# EAGLE design MAIN_STACK_V1 (EAGLE 7.5.0)
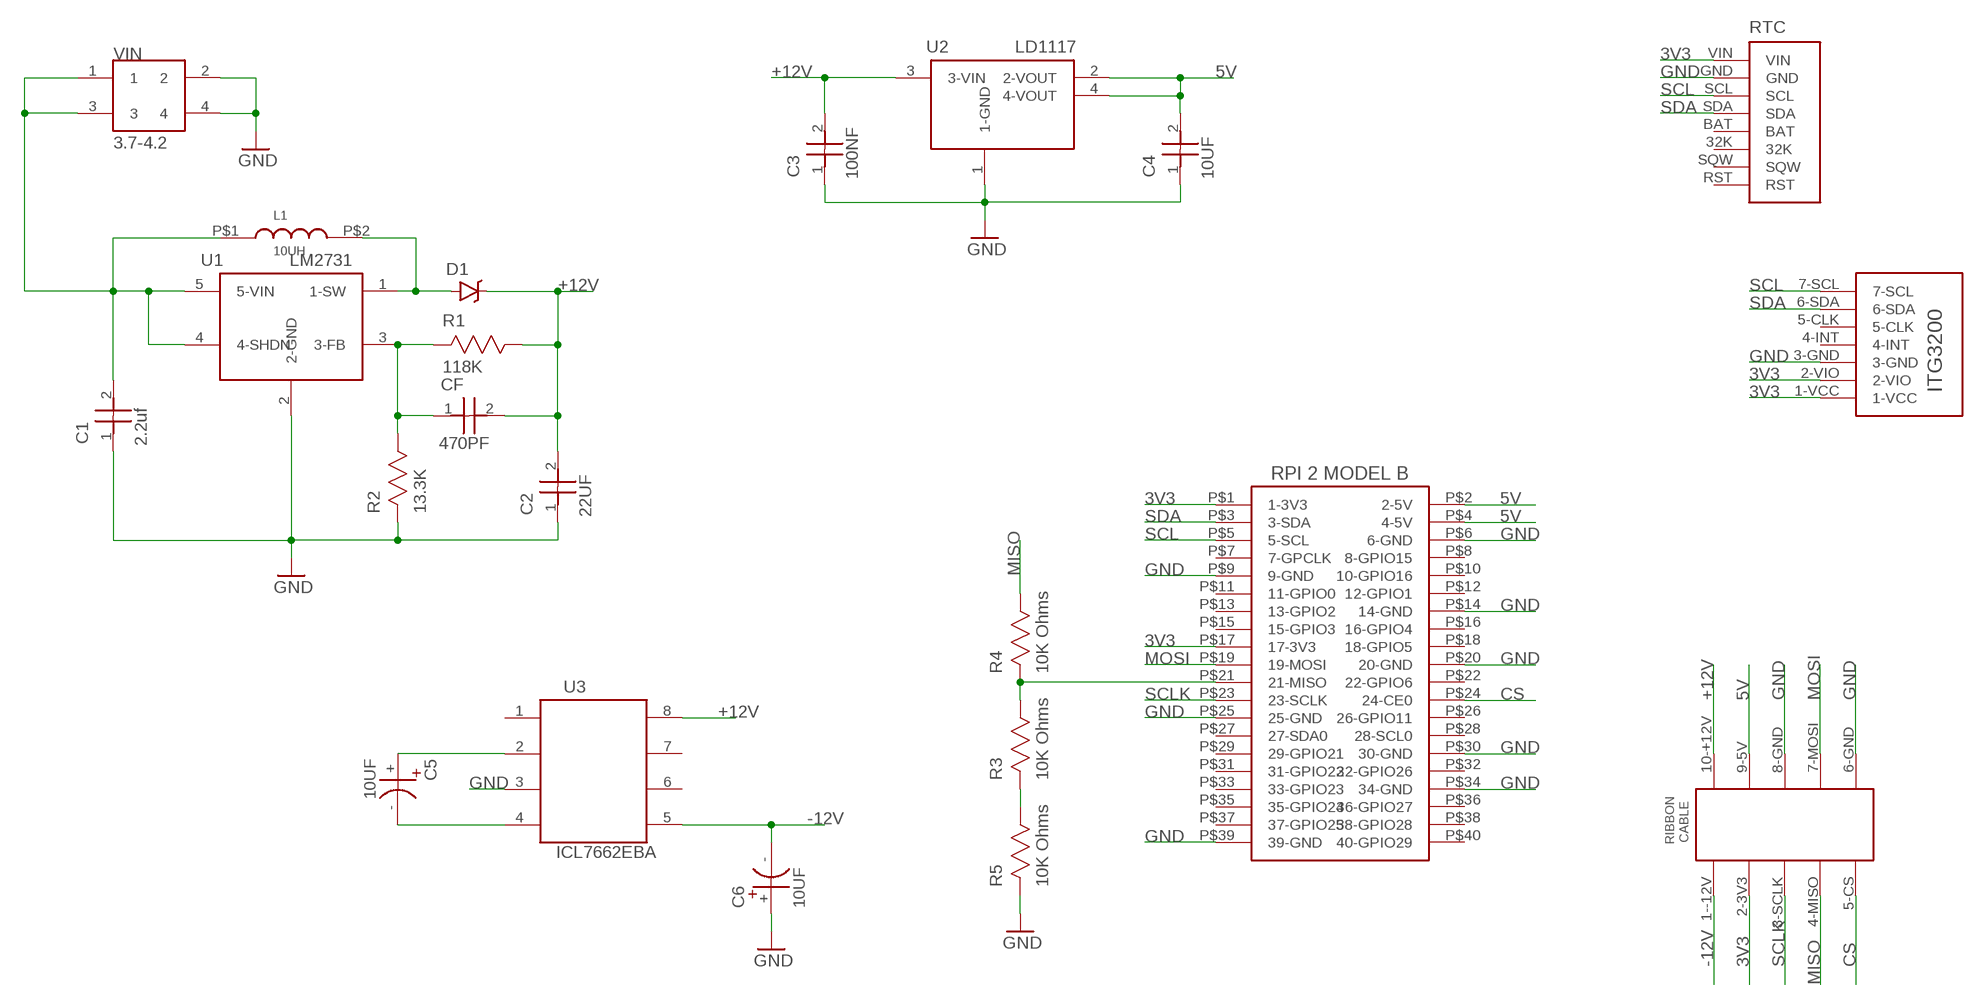
[diagram p0: schematic, sheet 1]

## Parts
C1  2.2uf  CAP1206  [CAP1206]
C2  22UF  CAP1206  [CAP1206]
C3  100NF  CAP1206  [CAP1206]
C4  10UF  CAP1206  [CAP1206]
C5  10UF  POLCAP9B  [KEMET9BPOLCAP]
C6  10UF  POLCAP9B  [KEMET9BPOLCAP]
CF  470PF  CAP1206  [CAP1206]
D1  DIODE-SCHOTTKY  [SOD-123]
L1  10UH  CDRH125NP  [CDRH125NP]
R1  118K  RES1206  [RES1206]
R2  13.3K  RES1206  [RES1206]
R3  10K Ohms  RES1206  [RES1206]
R4  10K Ohms  RES1206  [RES1206]
R5  10K Ohms  RES1206  [RES1206]
RTC  DS3231BREAKOUT  [DS3231BREAKOUT]
U1  LM2731  LM2731YMF/NOPB  [SOT95]
U2  LD1117  [SOT223]
U3  ICL7662EBA  [SOIC8]
U$1  RPI2  [RPI2]
U$2  ITG3200  [ITG3200]
U$3  5X2RIBBONCONNECTOR  [5X2RIBBONCONNECTOR]
VIN  3.7-4.2  HIROSECONNECTOR  [HIROSEPOWERCONNECTOR]

## Nets
3V3: RTC.VIN U$1.P$1(1-3V3) U$1.P$17(17-3V3) U$2.1-VCC U$2.2-VIO U$3.2-3V3
5V: C4.2 U2.2(2-VOUT) U2.4(4-VOUT) U$1.P$2(2-5V) U$1.P$4(4-5V) U$3.9-5V
+12V: C2.2 C3.2 CF.2 D1.C R1.1 U2.3(3-VIN) U3.8(8-V+) U$3.10-+12V
-12V: C6.- U3.5(5-VOUT) U$3.1--12V
CS: U$1.P$24(24-CE0) U$3.5-CS
GND: C1.1 C2.1 C3.1 C4.1 C6.+ R2.2 R5.2 RTC.GND U1.2(2-GND) U2.1(1-GND) U3.3(3-GND) U$1.P$6(6-GND) U$1.P$9(9-GND) U$1.P$14(14-GND) U$1.P$20(20-GND) U$1.P$25(25-GND) U$1.P$30(30-GND) U$1.P$34(34-GND) U$1.P$39(39-GND) U$2.3-GND U$3.6-GND U$3.8-GND VIN.2 VIN.4
MISO: R4.1 U$3.4-MISO
MOSI: U$1.P$19(19-MOSI) U$3.7-MOSI
N$2: C5.+ U3.2(2-CAP+)
N$3: D1.A L1.P$2 U1.1(1-SW)
N$4: C5.- U3.4(4-CAP-)
N$5: CF.1 R1.2 R2.1 U1.3(3-FB)
N$6: R3.1 R4.2 U$1.P$21(21-MISO)
N$7: R3.2 R5.1
SCL: RTC.SCL U$1.P$5(5-SCL) U$2.7-SCL
SCLK: U$1.P$23(23-SCLK) U$3.3-SCLK
SDA: RTC.SDA U$1.P$3(3-SDA) U$2.6-SDA
VIN: C1.2 L1.P$1 U1.4(4-SHDN) U1.5(5-VIN) VIN.1 VIN.3
Unconnected: RTC.32K RTC.BAT RTC.RST RTC.SQW U3.1(1-TEST) U3.6(6-LV) U3.7(7-OSC) U$1.P$7(7-GPCLK) U$1.P$8(8-GPIO15) U$1.P$10(10-GPIO16) U$1.P$11(11-GPIO0) U$1.P$12(12-GPIO1) U$1.P$13(13-GPIO2) U$1.P$15(15-GPIO3) U$1.P$16(16-GPIO4) U$1.P$18(18-GPIO5) U$1.P$22(22-GPIO6) U$1.P$26(26-GPIO11) U$1.P$27(27-SDA0) U$1.P$28(28-SCL0) U$1.P$29(29-GPIO21) U$1.P$31(31-GPIO22) U$1.P$32(32-GPIO26) U$1.P$33(33-GPIO23) U$1.P$35(35-GPIO24) U$1.P$36(36-GPIO27) U$1.P$37(37-GPIO25) U$1.P$38(38-GPIO28) U$1.P$40(40-GPIO29) U$2.4-INT U$2.5-CLK

## Library data of the parts
C1-C4 CF = RSC-16:CAP1206: CAPACITOR, 1206; MPN: C1206C103K5RACTU; OC_FARNELL: 1414713; OC_NEWARK: 61H7741; SUPPLIER: Kemet; TOLERANCE: ±10%; VALUE: 10nF; VOLTAGERATING: 50V
C5 C6 = RSC-16:POLCAP9B
D1 = RSC-16:DIODE-SCHOTTKY
L1 = RSC-16:CDRH125NP
R1 R2 = RSC-16:RES1206: RESISTOR, 1206; MPN: CRCW120610K0FKEA; OC_FARNELL: 1469970; OC_NEWARK: 53K1907; SUPPLIER: Vishay; TOLERANCE: ±1%; VALUE: 10K Ohms; WATTAGE: 0.25W
R3-R5 = RSC-16:RES1206: RESISTOR, 1206; MPN: CRCW120610K0FKEA; OC_FARNELL: 1469970; OC_NEWARK: 53K1907; SUPPLIER: Vishay; TOLERANCE: ±1%; WATTAGE: 0.25W
RTC = RSC-16:DS3231BREAKOUT
U1 = RSC-16:LM2731YMF/NOPB
U2 = RSC-16:LD1117
U3 = RSC-16:ICL7662EBA
U$1 = RSC-16:RPI2
U$2 = RSC-16:ITG3200
U$3 = RSC-16:5X2RIBBONCONNECTOR
VIN = RSC-16:HIROSECONNECTOR

## Board
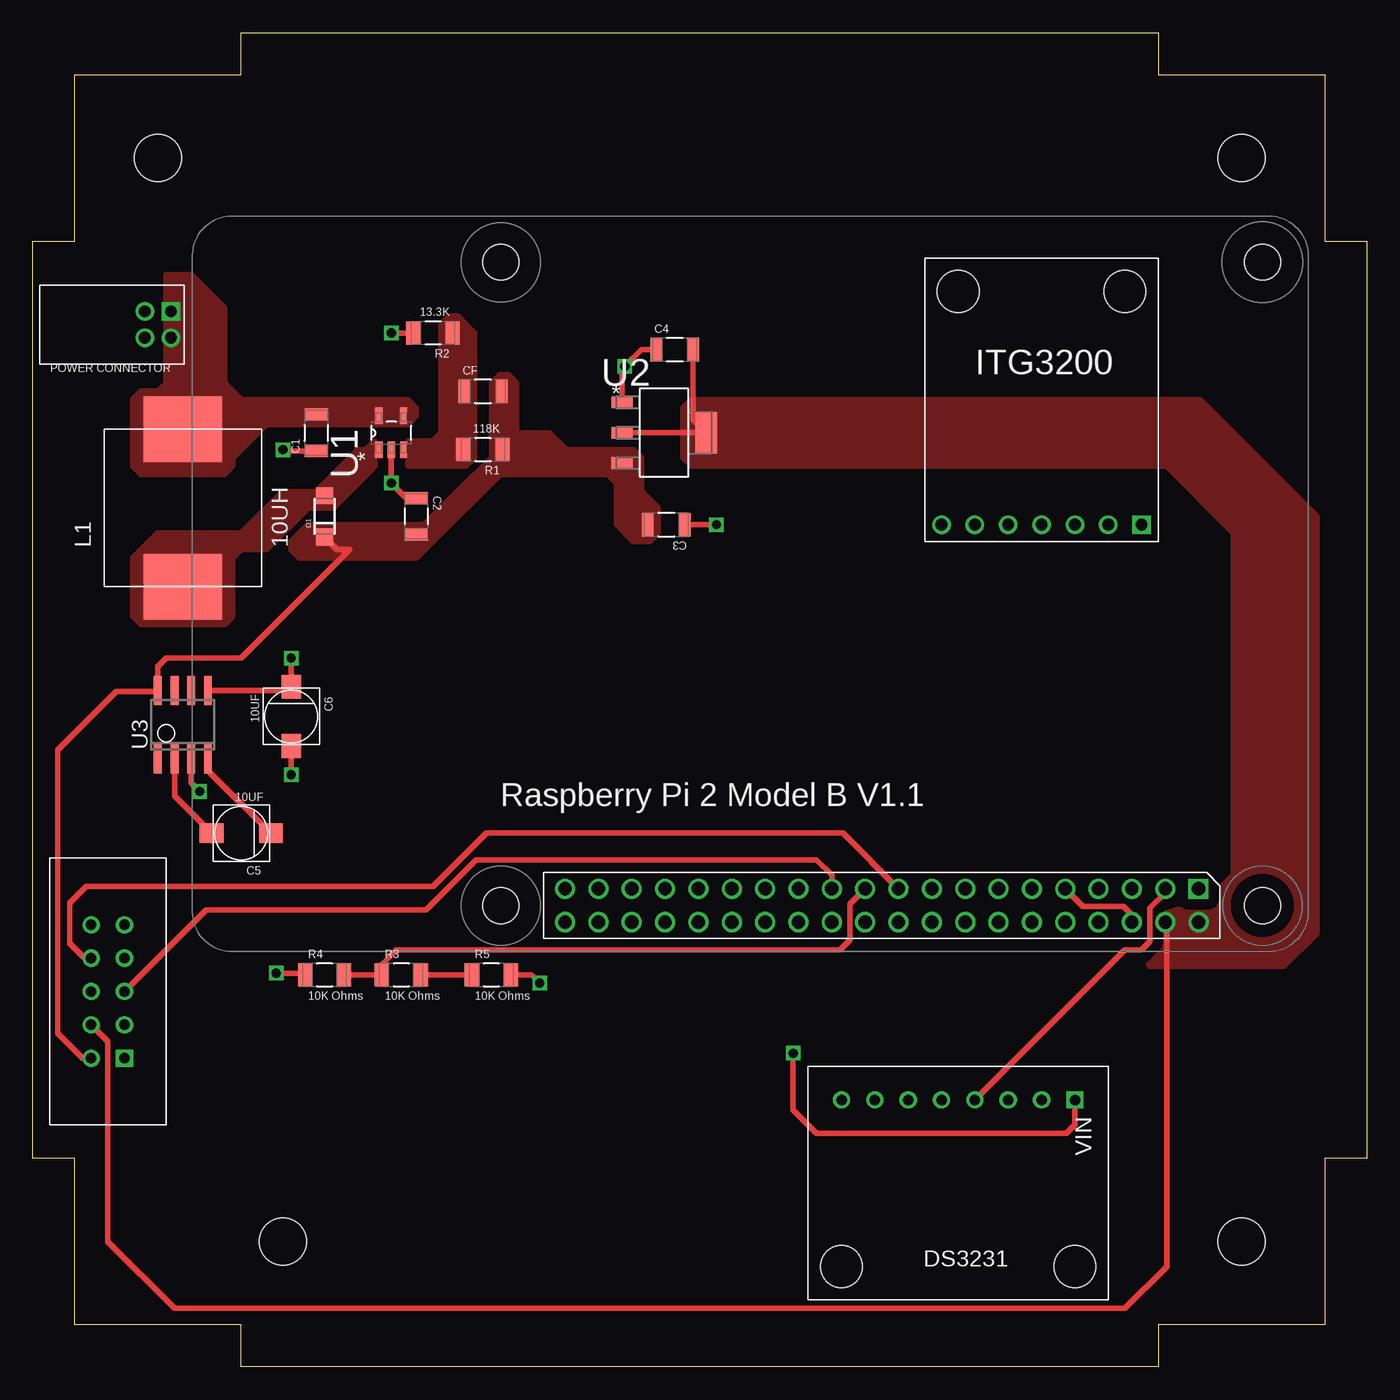
[diagram p1: board, top side]
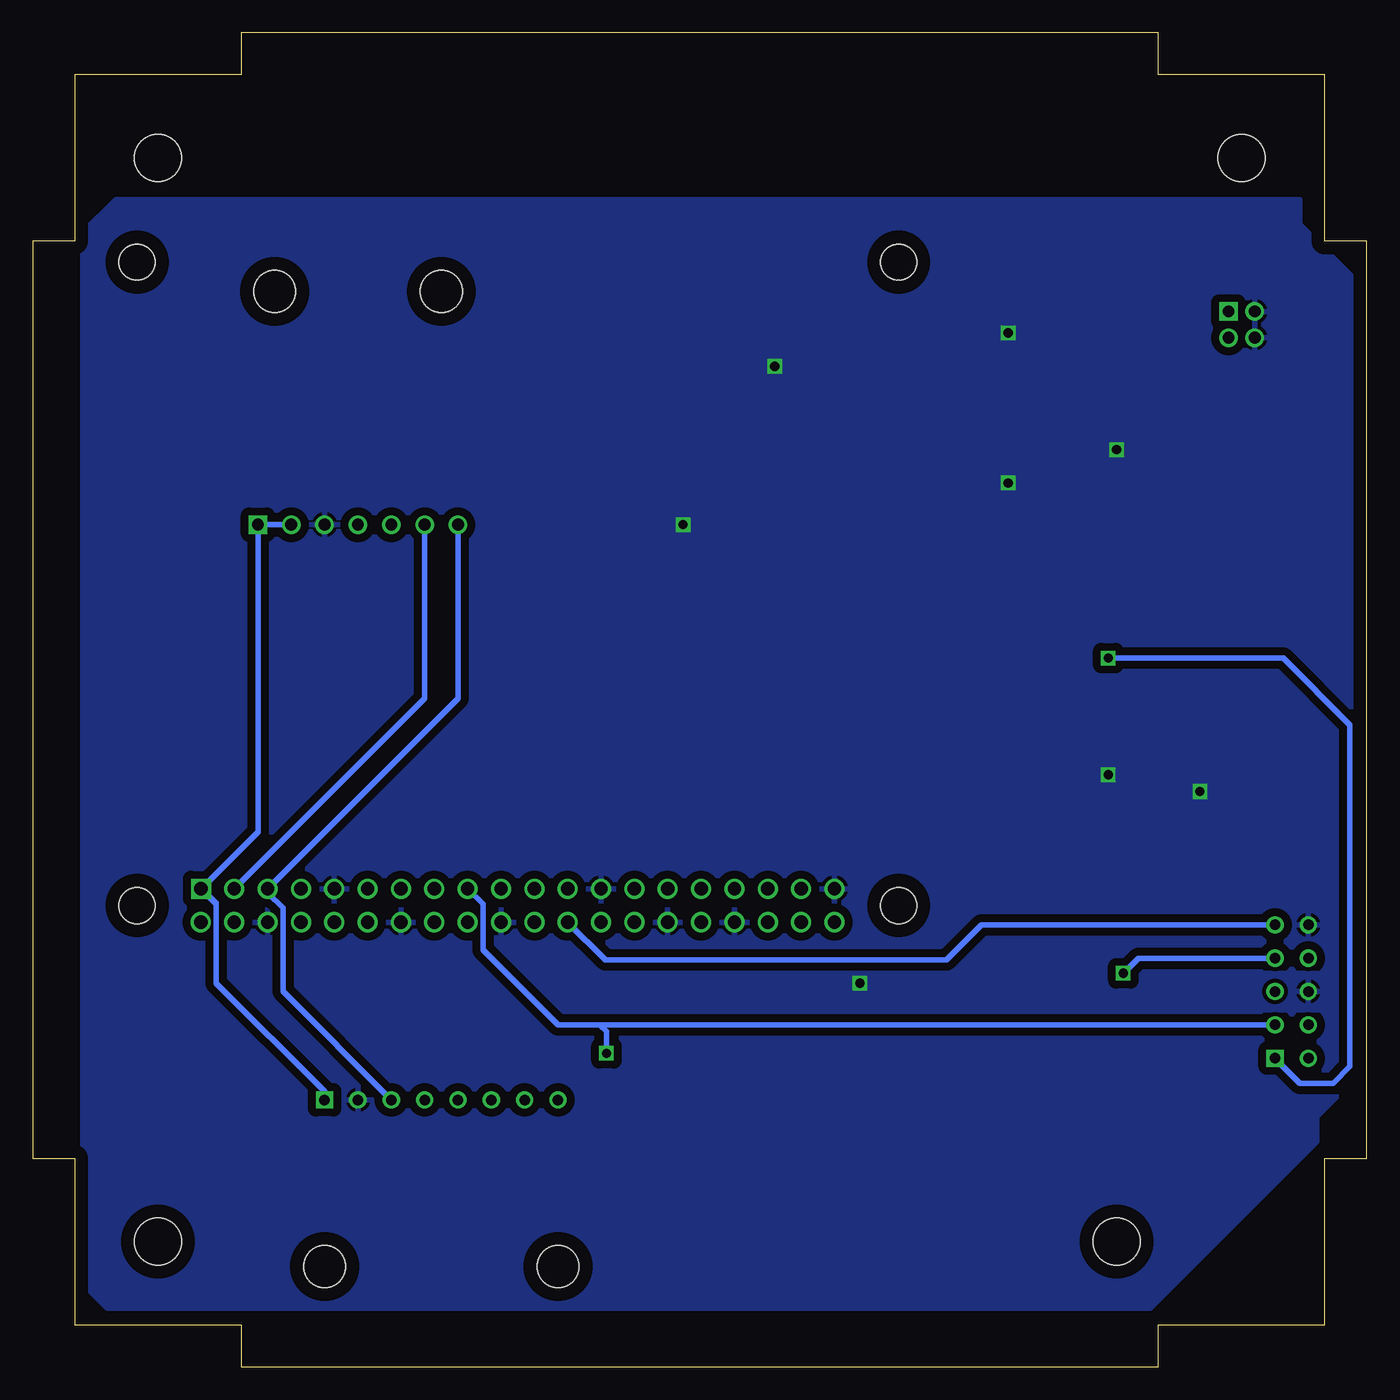
[diagram p2: board, bottom side, seen from below]

Size 101.6 x 101.6 mm. Coordinates in mm from the lower left corner, seen from the top.
Outline: 15.88,0 15.88,3.17 3.17,3.17 3.17,15.88 0,15.88 0,85.72 3.17,85.72 3.17,98.42 15.88,98.42 15.88,101.6 85.72,101.6 85.72,98.42 98.42,98.42 98.42,85.72 101.6,85.72 101.6,15.88 98.42,15.88 98.42,3.17 85.72,3.17 85.72,0 15.88,0
Copper layers (1*16): Top 0.035mm / dielectric 1.5mm / Bottom 0.035mm
Design rules "default": minimum track width 10mil, minimum drill 24mil, track to track 8mil, track to pad 8mil, pad to pad 8mil, via to via 8mil, smd to smd 8mil, copper to edge 40mil, drill to drill 8mil, minimum pad ring 10mil, minimum via ring 8mil, stop-mask expansion 4mil, vias tented up to drill 0mil, thermal gap 10mil
Holes 3.58 mm at 19.05,9.53 9.53,92.08 92.08,92.08 92.08,9.53

### Footprints (pad centres in the part's own frame; a part is rotated, then mirrored left to right if it is on the bottom)
CAP1206 = smd 0.914 x 1.803: 1 -1.397,0; 2 1.397,0
KEMET9BPOLCAP = smd 1.8 x 1.5: + 2.25,0; - -2.25,0
SOD-123 = smd 1.27 x 1.27: A 1.575,0; C -1.575,0
CDRH125NP = smd 6 x 5: P$1 0,6; P$2 0,-6
RES1206 = smd 1.118 x 1.753: 1 -1.473,0; 2 1.473,0
DS3231BREAKOUT = drill 0.8: 32K 15.24,2.54; BAT 12.7,2.54; GND 5.08,2.54; RST 20.32,2.54; SCL 7.62,2.54; SDA 10.16,2.54; SQW 17.78,2.54 | drill 0.8 square: VIN 2.54,2.54 | hole 3.2: 2.54,15.24; 20.32,15.24
SOT95 = smd 1.27 x 0.559: 1 -1.295,0.94; 2 -1.295,0; 3 -1.295,-0.94; 4 1.295,-0.94; 5 1.295,0.94
SOT223 = smd 1.626 x 0.889: 1 -3.2,2.311; 2 -3.2,0; 3 -3.2,-2.311 | smd 1.626 x 3.175: 4 3.2,0
SOIC8 = smd 0.6 x 2.2: 1 -1.905,-2.6; 2 -0.635,-2.6; 3 0.635,-2.6; 4 1.905,-2.6; 5 1.905,2.6; 6 0.635,2.6; 7 -0.635,2.6; 8 -1.905,2.6
RPI2 = drill 1.016 square: P$1 8.37,51.23 | drill 1.016: P$2 8.357,53.772; P$3 10.897,51.232; P$4 10.897,53.772; P$5 13.437,51.232; P$6 13.437,53.772; P$7 15.977,51.232; P$8 15.977,53.772; P$9 18.517,51.232; P$10 18.517,53.772; P$11 21.057,51.232; P$12 21.057,53.772; P$13 23.597,51.232; P$14 23.597,53.772; P$15 26.137,51.232; P$16 26.137,53.772; P$17 28.677,51.232; P$18 28.677,53.772; P$19 31.217,51.232; P$20 31.217,53.772; P$21 33.757,51.232; P$22 33.757,53.772; P$23 36.297,51.232; P$24 36.297,53.772; P$25 38.837,51.232; P$26 38.837,53.772; P$27 41.377,51.232; P$28 41.377,53.772; P$29 43.917,51.232; P$30 43.917,53.772; P$31 46.457,51.232; P$32 46.457,53.772; P$33 48.997,51.232; P$34 48.997,53.772; P$35 51.537,51.232; P$36 51.537,53.772; P$37 54.077,51.232; P$38 54.077,53.772; P$39 56.617,51.232; P$40 56.617,53.772 | hole 2.75: 3.5,3.5; 61.5,3.5; 3.5,52.5; 61.5,52.5
ITG3200 = drill 0.9 square: 1-VCC 20.32,16.51 | drill 0.9: 2-VIO 20.32,13.97; 3-GND 20.32,11.43; 4-INT 20.32,8.89; 5-CLK 20.32,6.35; 6-SDA 20.32,3.81; 7-SCL 20.32,1.27 | hole 3.2: 2.54,15.24; 2.54,2.54
5X2RIBBONCONNECTOR = drill 0.8 square: 1--12V -5.08,-1.27 | drill 0.8: 2-3V3 -2.54,-1.27; 3-SCLK 0,-1.27; 4-MISO 2.54,-1.27; 5-CS 5.08,-1.27; 6-GND 5.08,1.27; 7-MOSI 2.54,1.27; 8-GND 0,1.27; 9-5V -2.54,1.27; 10-+12V -5.08,1.27
HIROSEPOWERCONNECTOR = drill 0.9 square: 1 1,-1 | drill 0.9: 2 1,1; 3 -1,-1; 4 -1,1

### Placement (x,y rotation side)
C1  21.59,71.12 90 top
C2  29.21,64.77 270 top
C3  48.26,64.14 180 top
C4  48.9,77.47 0 top
C5  15.88,40.64 180 top
C6  19.68,49.53 270 top
CF  34.29,74.3 0 top
D1  22.23,64.77 90 top
L1  11.43,65.41 0 top
R1  34.29,69.85 180 top
R2  30.48,78.74 180 top
R3  28.07,29.84 0 top
R4  22.23,29.84 0 top
R5  34.92,29.84 0 top
RTC  81.92,22.86 180 top
U1  27.3,71.12 90 top
U2  48.09,71.14 0 top
U3  11.43,48.9 0 top
U$1  97.16,87.63 180 top
U$2  67.94,84.45 270 top
U$3  5.71,28.57 90 top
VIN  9.53,79.38 90 top

### Tracks (layer width: path | path; a pad name or v marks a point on that pad's centre or on a via)
3V3  (via drill 0.7)
  Top 0.406: RTC.VIN 79.38,18.41 78.74,17.78 59.69,17.78 57.91,19.56 v57.91,23.88
  Bottom 0.406: U$2.2-VIO U$2.1-VCC 84.45,40.73 U$1.P$1 87.63,35.24 | 87.63,35.24 87.63,29.21 79.38,20.95 RTC.VIN | U$3.2-3V3 58.42,26.04 | 58.42,26.04 61.59,26.04 67.31,31.75 67.31,35.23 U$1.P$17 | 87.63,35.24 87.63,35.31 88.65,36.32 | v57.91,23.88 57.91,25.53 58.42,26.04
5V
  Top 0.406: C4.2 50.29,72.13 U2.4 U2.2 | U$3.9-5V 5.71,24.77 5.71,9.53 10.79,4.45 83.19,4.45 86.36,7.62 86.36,33.76 U$1.P$4
  pour Top (isolate 0.813, no thermals): 49.53,70.48 49.53,69.22 50.16,68.58 86.36,68.58 91.44,63.5 91.44,37.47 89.53,35.56 85.09,35.56 84.45,34.92 84.45,31.11 85.09,30.48 95.25,30.48 97.79,33.02 97.79,64.77 88.9,73.66 50.16,73.66 49.53,73.03
+12V
  Top 0.406: D1.C 23.19,62.23 24.13,62.23 15.88,53.98 10.16,53.98 9.53,53.34 U3.8 9.46,51.44 6.35,51.44 1.91,46.99 1.91,25.4 3.81,23.5 U$3.10-+12V
  pour Top (no thermals): 20.95,64.14 19.68,62.87 19.68,62.23 20.32,61.59 29.21,61.59 36.83,69.22 36.83,74.93 36.2,75.56 35.56,75.56 34.92,74.93 34.92,69.22 33.66,67.94 29.84,64.14
  pour Top: 34.92,71.12 39.37,71.12 40.64,69.85 45.72,69.85 46.35,69.22 46.35,68.58 45.72,67.94 35.56,67.94 34.92,68.58
  pour Top (no thermals): 45.72,69.85 46.35,69.22 46.35,66.67 47.62,65.41 47.62,63.5 46.99,62.87 45.72,62.87 44.45,64.14 44.45,67.31 43.81,67.94 43.81,69.22 44.45,69.85
-12V  (via drill 0.7)
  Top 0.406: U3.5 19.4,51.49 C6.- v19.68,53.98
  Bottom 0.406: U$3.1--12V 5.08,21.59 2.54,21.59 1.27,22.86 1.27,48.9 6.35,53.98 v19.68,53.98
CS
  Bottom 0.406: U$3.5-CS 29.34,33.66 32,30.99 57.99,30.99 U$1.P$24
GND  (via drill 0.7)
  Top 0.406: C1.1 19.18,69.72 v19.05,69.85 | R2.2 v27.3,78.74 | C2.1 28.45,66.17 v27.3,67.31 U1.2 | U2.1 44.88,76 v45.09,76.2 46.35,77.47 C4.1 | v52.07,64.14 C3.1 | C6.+ v19.68,45.09 | U3.3 12.06,44.45 v12.7,43.81 | U$1.P$6 83.72,34.39 83.06,35.05 79.98,35.05 U$1.P$9 | R5.2 37.97,29.84 v38.61,29.21
  pour Bottom (isolate 0.61): 5.08,88.9 95.25,88.9 97.79,86.36 97.79,6.35 95.89,4.45 16.51,4.45 3.81,17.14 3.81,19.05 0.64,22.23 0.64,82.55 5.08,87
  pour Bottom (isolate 0.305): 3.81,29.97 8.13,29.97 8.64,29.46 8.64,27.69 8.13,27.18 3.56,27.18 3.3,27.43 3.3,29.46
MISO  (via drill 0.7)
  Top 0.406: v18.54,29.97 20.62,29.97 R4.1
  Bottom 0.406: U$3.4-MISO 17.4,31.11 v18.54,29.97
MOSI
  Top 0.406: U$3.7-MOSI 3.94,31.11 2.79,32.26 2.79,35.31 4.06,36.58 30.48,36.58 34.54,40.64 61.7,40.64 U$1.P$19
N$2
  Top 0.406: U3.2 10.79,43.47 C5.+
N$3
  pour Top (isolate 0.813, no thermals): 7.62,57.15 8.26,56.52 14.61,56.52 15.24,57.15 15.24,61.59 15.88,62.23 17.78,62.23 20.95,65.41 22.86,65.41 26.67,69.22 26.67,70.48 26.04,70.48 25.4,69.85 24.77,69.85 21.59,66.67 19.05,66.67 15.88,63.5 9.53,63.5 7.62,61.59
N$4
  Top 0.406: U3.4 13.34,45.43 C5.-
N$5
  pour Top (isolate 0.813, no thermals): 33.02,68.58 33.66,69.22 33.66,78.74 32.38,80.01 31.75,80.01 31.11,79.38 31.11,71.12 30.48,70.48 28.57,70.48 27.94,69.85 27.94,69.22 28.57,68.58
N$6
  Top 0.406: R4.2 R3.1 26.59,30.66 27.69,31.75 61.47,31.75 62.23,32.51 62.23,35.23 U$1.P$21
N$7
  Top 0.406: R3.2 R5.1
SCL
  Bottom 0.406: U$2.7-SCL 69.22,50.9 U$1.P$5 83.72,36.09 82.55,34.92 82.55,28.57 RTC.SCL
SCLK
  Top 0.406: U$1.P$23 60.86,37.44 59.69,38.61 33.78,38.61 29.97,34.8 13.21,34.8 U$3.3-SCLK
SDA
  Top 0.406: U$1.P$3 86.26,36.09 85.09,34.92 85.09,32.38 84.45,31.75 83.19,31.75 RTC.SDA
  Bottom 0.406: U$2.6-SDA 71.75,50.9 U$1.P$3
VIN
  pour Top (no thermals): 10.16,83.19 10.16,74.93 9.53,74.3 8.26,74.3 7.62,73.66 7.62,68.58 8.26,67.94 14.61,67.94 15.24,68.58 15.24,69.22 17.78,71.75 28.57,71.75 29.21,72.39 29.21,73.03 28.57,73.66 15.88,73.66 14.61,74.93 14.61,80.64 12.06,83.19